# Altium schematic sheet 0192_GPP_MUX_C.SchDoc
size A3
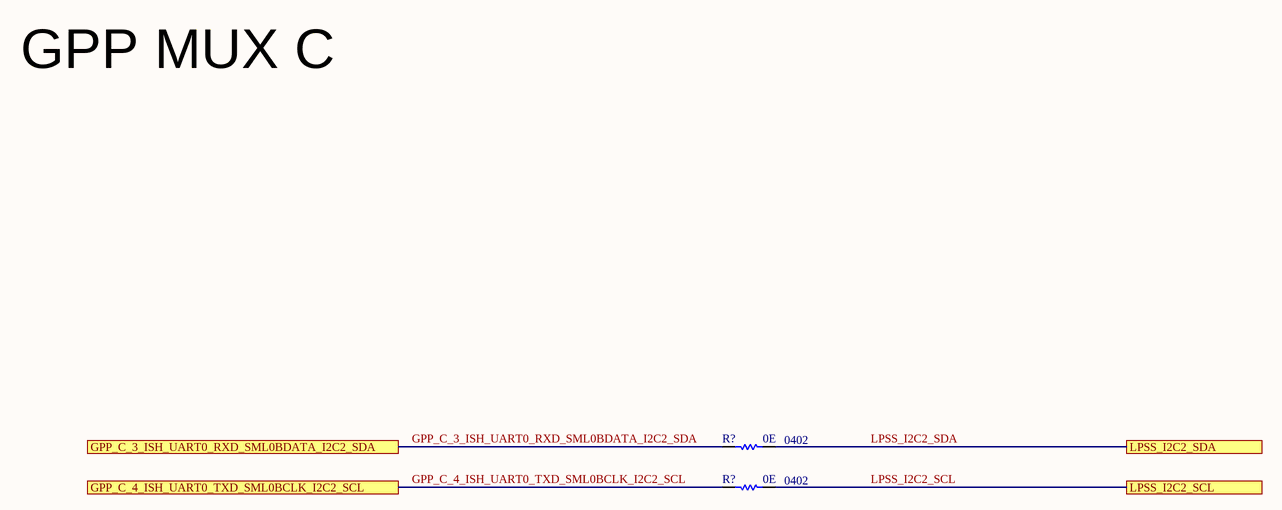
[diagram p0: 0192_GPP_MUX_C.SchDoc]

## Parts
(Parts that share a designator on the sheet are numbered #1, #2 ... from top to bottom, then left to right.)
R?#1  value 0E  Case/Package: 0402  [RESC0402]  (hidden comment: Res)
R?#2  value 0E  Case/Package: 0402  [RESC0402]  (hidden comment: Res)

## Ports
GPP_C_3_ISH_UART0_RXD_SML0BDATA_I2C2_SDA, GPP_C_4_ISH_UART0_TXD_SML0BCLK_I2C2_SCL, LPSS_I2C2_SCL, LPSS_I2C2_SDA

## Nets
GPP_C_3_ISH_UART0_RXD_SML0BDATA_I2C2_SDA: R?#1.1 ; port GPP_C_3_ISH_UART0_RXD_SML0BDATA_I2C2_SDA
GPP_C_4_ISH_UART0_TXD_SML0BCLK_I2C2_SCL: R?#2.1 ; port GPP_C_4_ISH_UART0_TXD_SML0BCLK_I2C2_SCL
LPSS_I2C2_SCL: R?#2.2 ; port LPSS_I2C2_SCL
LPSS_I2C2_SDA: R?#1.2 ; port LPSS_I2C2_SDA

## Notes on the sheet
- GPP MUX C

## Library data of the parts
R?#1 R?#2 = Res: Thick Film Resistor -  0ohm, 1%,0402